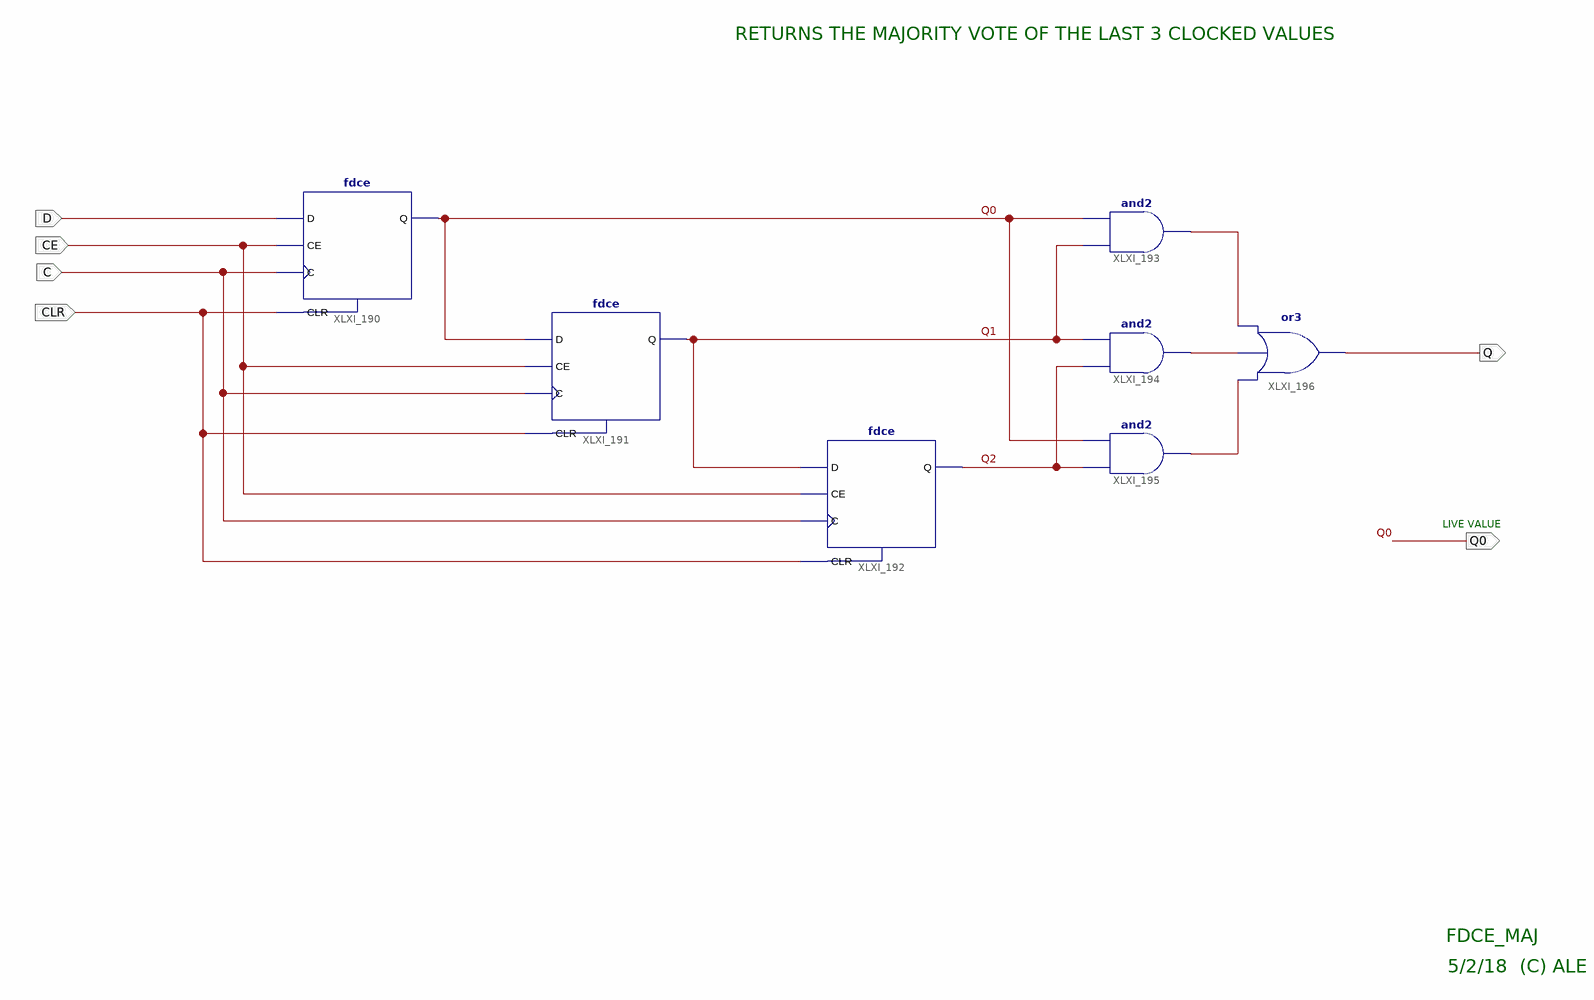
[diagram p0: schematic sheet 1]
// Xilinx ISE schematic DB_FDCE_Maj.sch (aspartan3e) as structural Verilog: 7 symbols, 6 ports
module DB_FDCE_Maj (
  input  C,
  input  CE,
  input  D,
  input  CLR,
  output Q0,
  output Q
);

  wire Q1, Q2, XLXN_170, XLXN_171, XLXN_172;

  fdce XLXI_190 (.C(C), .CE(CE), .CLR(CLR), .D(D), .Q(Q0));
  fdce XLXI_191 (.C(C), .CE(CE), .CLR(CLR), .D(Q0), .Q(Q1));
  fdce XLXI_192 (.C(C), .CE(CE), .CLR(CLR), .D(Q1), .Q(Q2));
  and XLXI_195 (XLXN_172, Q2, Q0);
  and XLXI_194 (XLXN_171, Q2, Q1);
  and XLXI_193 (XLXN_170, Q1, Q0);
  or XLXI_196 (Q, XLXN_172, XLXN_171, XLXN_170);

  // Notes on the sheet:
  //   RETURNS THE MAJORITY VOTE OF THE LAST 3 CLOCKED VALUES
  //   LIVE VALUE
  //   FDCE_MAJ
  //   5/2/18  (C) ALE
endmodule
